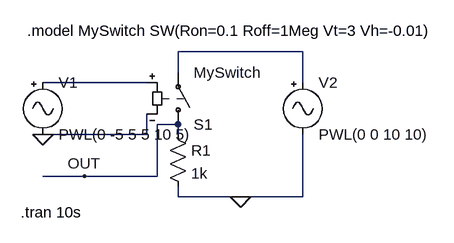
[diagram p0: schematic single_SW_test.asc]
single_SW_test.asc, the LTspice schematic file:
Version 4
SHEET 1 880 680
WIRE 400 80 208 80
WIRE 208 112 208 80
WIRE 160 128 0 128
WIRE 400 128 400 80
WIRE 208 192 176 192
WIRE 160 208 160 176
WIRE 160 208 0 208
WIRE 208 208 208 192
WIRE 64 272 0 272
WIRE 176 272 176 192
WIRE 176 272 64 272
WIRE 208 304 208 288
WIRE 304 304 208 304
WIRE 400 304 400 208
WIRE 400 304 304 304
FLAG 304 304 0
FLAG 64 272 OUT
FLAG 0 208 0
SYMBOL sw 208 208 M180
SYMATTR InstName S1
SYMATTR Value MySwitch
SYMBOL Misc\\signal 0 112 R0
WINDOW 123 0 0 Left 0
WINDOW 39 0 0 Left 0
SYMATTR InstName V1
SYMATTR Value PWL(0 -5 5 5 10 5)
SYMBOL Misc\\signal 400 112 R0
WINDOW 123 0 0 Left 0
WINDOW 39 0 0 Left 0
SYMATTR InstName V2
SYMATTR Value PWL(0 0 10 10)
SYMBOL res 192 192 R0
SYMATTR InstName R1
SYMATTR Value 1k
TEXT -24 48 Left 2 !.model MySwitch SW(Ron=0.1 Roff=1Meg Vt=3 Vh=-0.01)
TEXT -34 328 Left 2 !.tran 10s

The netlist it stands for:
* single_SW_test.asc
S1 OUT N001 N002 0 MySwitch
V1 N002 0 PWL(0 -5 5 5 10 5)
V2 N001 0 PWL(0 0 10 10)
R1 OUT 0 1k
.model MySwitch SW(Ron=0.1 Roff=1Meg Vt=3 Vh=-0.01)
.tran 10s
.backanno
.end